# EAGLE design Arduino-Pro-Mini-v11 (EAGLE 5.11)
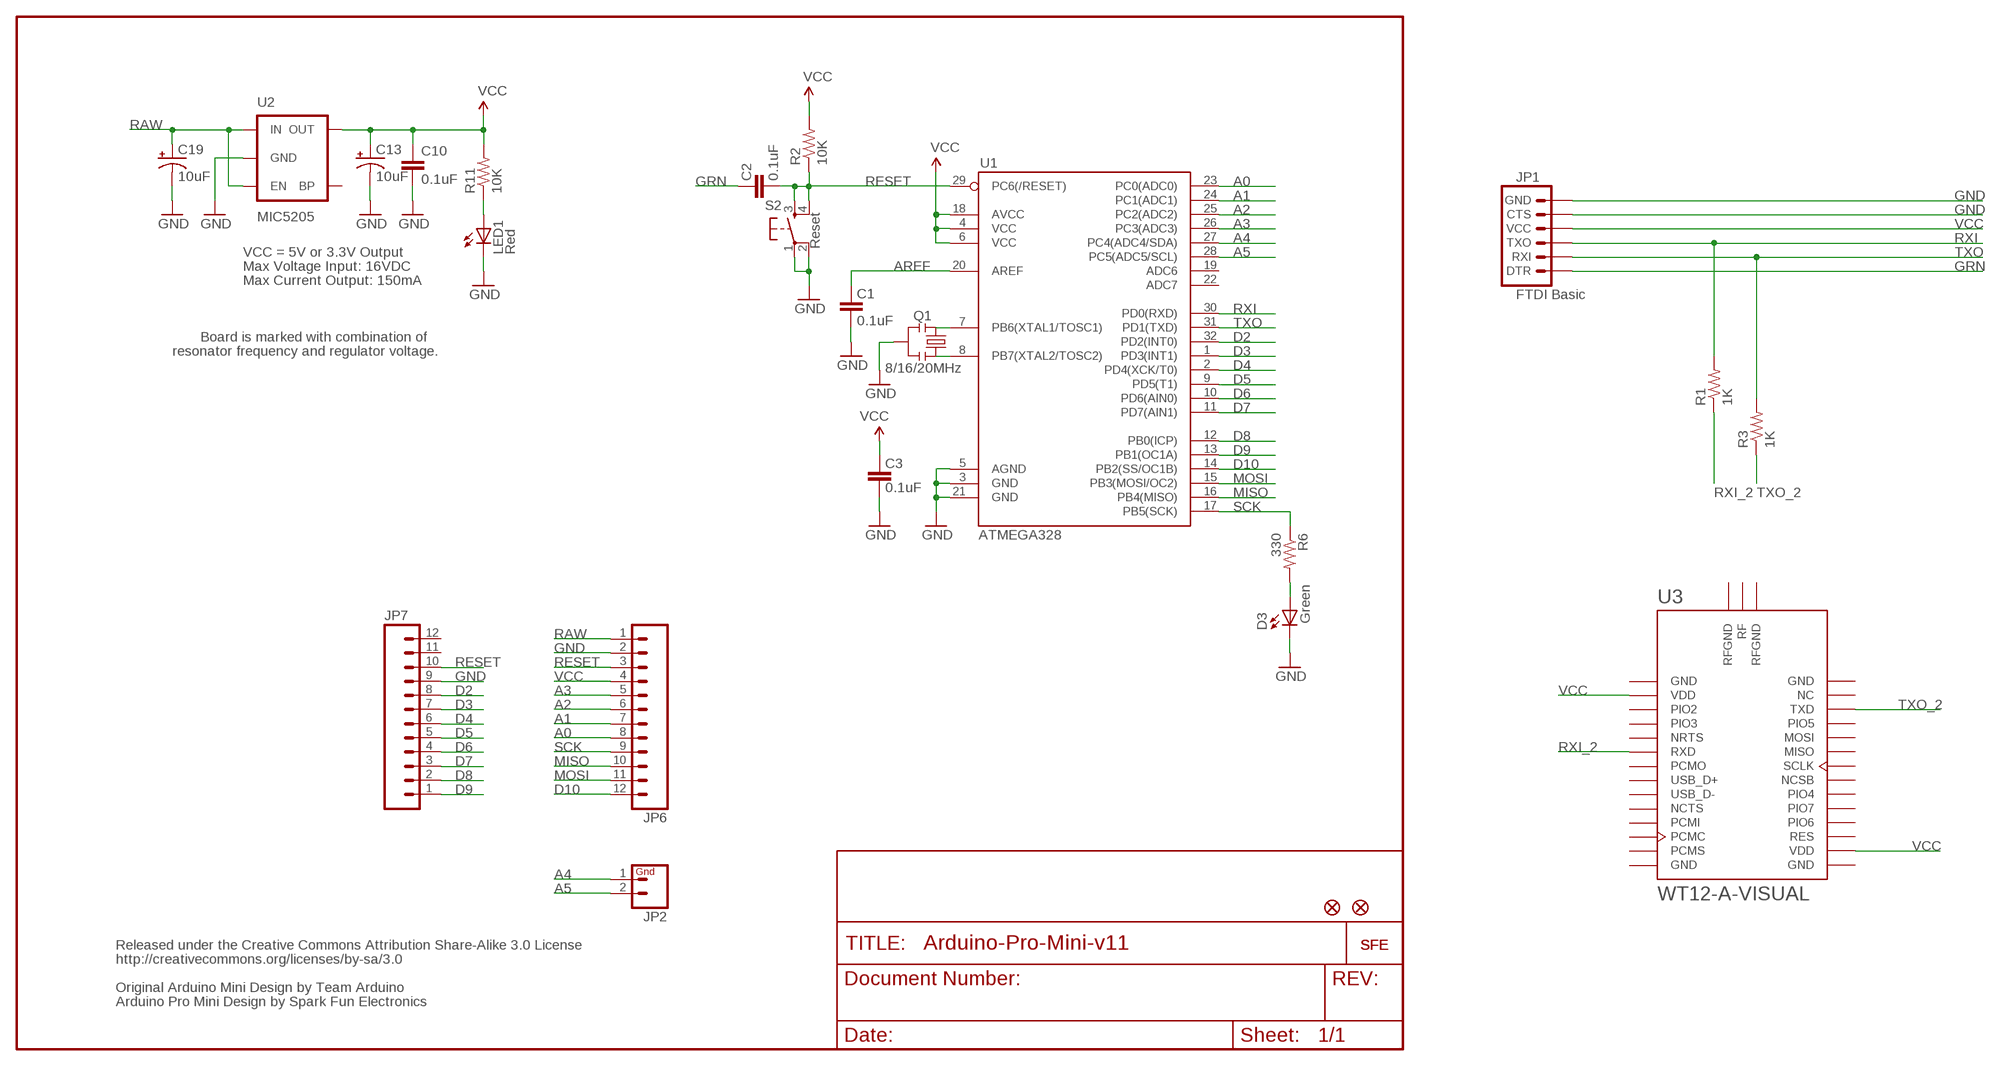
[diagram p0: schematic, sheet 1]

## Parts
C1  0.1uF  CAP0402  [C0402]
C2  0.1uF  CAP0402  [C0402]
C3  0.1uF  CAP0402  [C0402]
C10  0.1uF  CAP0402  [C0402]
C13  10uF  CAP_POL1206  [EIA3216]
C19  10uF  CAP_POL1206  [EIA3216]
D3  Green  LED0603  [LED-0603]
JP1  FTDI Basic  ARDUINO_SERIAL_PROGRAMPTH  [1X06]
JP2  M02PTH  [1X02]
JP6  M12PTH  [1X12]
JP7  M12PTH  [1X12]
LED1  Red  LED0603  [LED-0603]
Q1  8/16/20MHz  RESONATORSMD  [RESONATOR-SMD]
R1  1K  RESISTOR0402  [C0402]
R2  10K  RESISTOR0402  [C0402]
R3  1K  RESISTOR0402  [C0402]
R6  330  RESISTOR0402  [C0402]
R11  10K  RESISTOR0402  [C0402]
S2  Reset  TAC_SWITCHSND  [TACTILE_SWITCH_SMD]
U1  ATMEGA328  ATMEGA168  [TQFP32-08]
U2  MIC5205  V_REG_LDOSMD  [SOT23-5]
U3  WT12-A-VISUAL  [WT12-A]
U$1  LOGO-SFESK  [SFE-LOGO-FLAME]
U$2  FIDUCIAL1X2  [FIDUCIAL-1X2]
U$4  FIDUCIAL1X2  [FIDUCIAL-1X2]
U$11  LOGO-SFENEW  [SFE-NEW-WEBLOGO]

## Nets
A0: JP6.8 U1.23(PC0(ADC0))
A1: JP6.7 U1.24(PC1(ADC1))
A2: JP6.6 U1.25(PC2(ADC2))
A3: JP6.5 U1.26(PC3(ADC3))
A4: JP2.1 U1.27(PC4(ADC4/SDA))
A5: JP2.2 U1.28(PC5(ADC5/SCL))
AREF: C1.2 U1.20(AREF)
D2: JP7.8 U1.32(PD2(INT0))
D3: JP7.7 U1.1(PD3(INT1))
D4: JP7.6 U1.2(PD4(XCK/T0))
D5: JP7.5 U1.9(PD5(T1))
D6: JP7.4 U1.10(PD6(AIN0))
D7: JP7.3 U1.11(PD7(AIN1))
D8: JP7.2 U1.12(PB0(ICP))
D9: JP7.1 U1.13(PB1(OC1A))
D10: JP6.12 U1.14(PB2(SS/OC1B))
GND [vcc]: C1.1 C3.1 C10.2 C13.C(-) C19.C(-) D3.C JP1.5(CTS) JP1.6(GND) JP6.2 JP7.9 LED1.C Q1.2 S2.1 S2.2 U1.3(GND) U1.5(AGND) U1.21(GND) U2.2(GND)
GRN: C2.2 JP1.1(DTR)
MISO: JP6.10 U1.16(PB4(MISO))
MOSI: JP6.11 U1.15(PB3(MOSI/OC2))
N$1: Q1.1 U1.8(PB7(XTAL2/TOSC2))
N$2: Q1.3 U1.7(PB6(XTAL1/TOSC1))
N$7: D3.A R6.2
N$38: LED1.A R11.1
RAW [vcc]: C19.A(+) JP6.1 U2.1(IN) U2.3(EN)
RESET: C2.1 JP6.3 JP7.10 R2.1 S2.3 S2.4 U1.29(PC6(/RESET))
RXI: JP1.3(TXO) R1.2 U1.30(PD0(RXD))
RXI_2: R1.1 U3.RXD
SCK: JP6.9 R6.1 U1.17(PB5(SCK))
TXO: JP1.2(RXI) R3.2 U1.31(PD1(TXD))
TXO_2: R3.1 U3.TXD
VCC: C3.2 C10.1 C13.A(+) JP1.4(VCC) JP6.4 R2.2 R11.2 U1.4(VCC) U1.6(VCC) U1.18(AVCC) U2.5(OUT) U3.VDD1(VDD) U3.VDD2(VDD)
Unconnected: JP7.11 JP7.12 U1.19(ADC6) U1.22(ADC7) U2.4(BP) U3.MISO U3.MOSI U3.NC U3.NCSB U3.NCTS U3.NRTS U3.PCMC U3.PCMI U3.PCMO U3.PCMS U3.PIO2 U3.PIO3 U3.PIO4 U3.PIO5 U3.PIO6 U3.PIO7 U3.RES U3.RF U3.RFGND1(RFGND) U3.RFGND2(RFGND) U3.SCLK U3.USB_D+ U3.USB_D-

## Notes on the sheet
- VCC = 5V or 3.3V Output
- Max Voltage Input: 16VDC
- Max Current Output: 150mA
- Board is marked with combination of
- resonator frequency and regulator voltage.
- Released under the Creative Commons Attribution Share-Alike 3.0 License
- http://creativecommons.org/licenses/by-sa/3.0
- Original Arduino Mini Design by Team Arduino
- Arduino Pro Mini Design by Spark Fun Electronics

## Power pins joined to a net without a drawn wire
GND: U3.GND1(GND) U3.GND2(GND) U3.GND3(GND) U3.GND4(GND)

## Library data of the parts
C1-C3 C10 = SparkFun:CAP: Capacitor Standard 0603 ceramic capacitor, and 0.1" leaded capacitor.
C13 C19 = SparkFun:CAP_POL: Capacitor Polarized These are standard SMD and PTH capacitors. Normally 10uF, 47uF, and 100uF in electrolytic and tantalum varieties. Always verify the external diameter of the through hole cap, it varies with capacity, voltage, and manufacturer. The EIA devices should be standard.
D3 LED1 = SparkFun:LED: LEDs Standard schematic elements and footprints for 5mm, 3mm, 1206, and 0603 sized LEDs. 5mm - Spark Fun Electronics SKU : COM-00529 (and others)
JP1 = SparkFun:ARDUINO_SERIAL_PROGRAM
JP2 = SparkFun:M02: Header 2 Standard 2-pin 0.1" header. Use with straight break away headers (SKU : PRT-00116), right angle break away headers (PRT-00553), swiss pins (PRT-00743), machine pins (PRT-00117), and female headers (PRT-00115). Molex polarized connector foot print use with SKU : PRT-08233 with associated crimp pins and housings.
JP6 JP7 = SparkFun:M12: Header 12 Standard 12-pin 0.1" header. Use with straight break away headers (SKU : PRT-00116), right angle break away headers (PRT-00553), swiss pins (PRT-00743), machine pins (PRT-00117), and female headers (PRT-00115).
Q1 = SparkFun:RESONATOR: Resonator Small SMD resonator. This is the itty bitty 10/20MHz resonators with built in caps. CSTCE10M0G55 and CSTCE20M0V53. Footprint has been reviewed closely but hasn't been tested yet.
R1-R3 R6 R11 = SparkFun:RESISTOR: Resistor Basic schematic elements and footprints for 0603, 1206, and PTH 1/10th watt (small) resistors.
S2 = SparkFun:TAC_SWITCH: Momentary Switch Button commonly used for reset or general input. Spark Fun Electronics SKU : COM-00097
U1 = SparkFun:ATMEGA168
U2 = SparkFun:V_REG_LDO: Voltage Regulator LDO Standard 150mA LDO voltage regulator in SOT-23 layout. Micrel part MIC5205. BP (by-pass) pin is used to lower output noise with 470pF cap.
U3 = bluegiga:WT12-A-VISUAL: Class 2 Bluetooth 2.1 + EDR module, chip antenna and RF pins
U$1 U$11 = SparkFun:LOGO-SFE: Spark Fun Electronics PCB Logo This is the standard Spark Fun Electronics PCB logo.
U$2 U$4 = SparkFun:FIDUCIAL: Fiducial Alignment Points Various fiducial points for machine vision alignment.

## Net classes
0 default: width 0.203 mm
1 vcc: width 0.254 mm

## Board
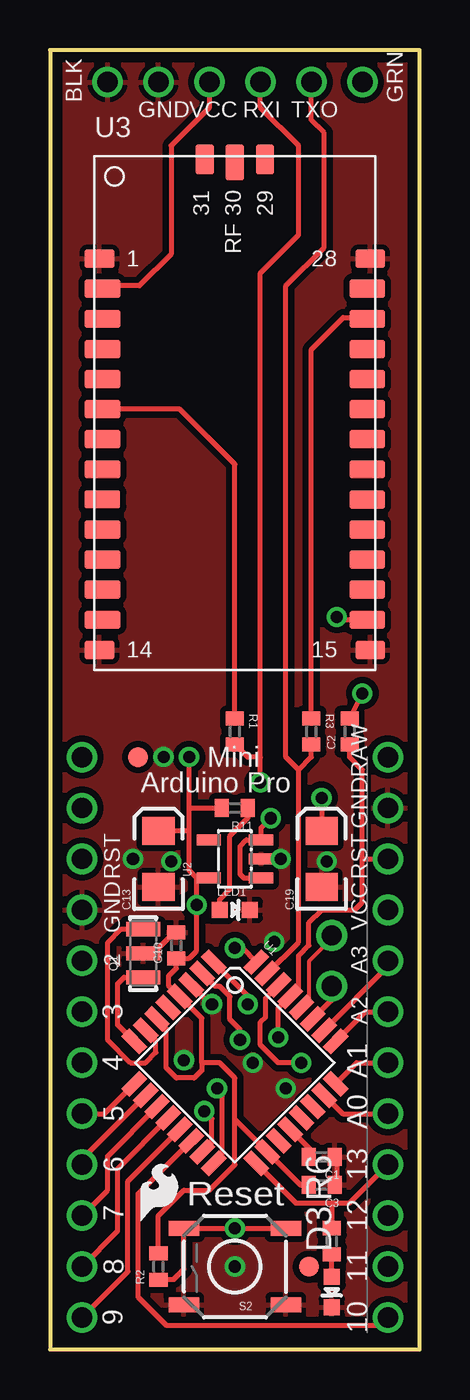
[diagram p1: board, top side]
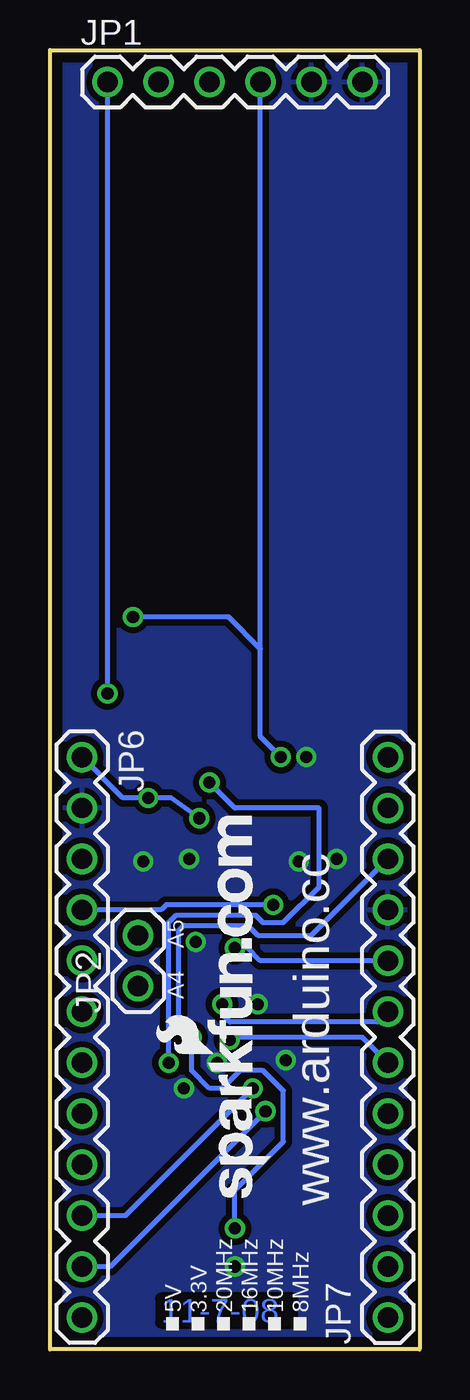
[diagram p2: board, bottom side, seen from below]

Size 18.41 x 64.77 mm. Coordinates in mm from the lower left corner, seen from the top.
Outline: 0,64.77 0,0 18.42,0 18.42,64.77 0,64.77
Copper layers (1*16): Top 0.035mm / dielectric 1.5mm / Bottom 0.035mm
Design rules "8mils": minimum track width 8mil, minimum drill 0.6mm, track to track 8mil, track to pad 8mil, pad to pad 8mil, via to via 8mil, smd to smd 0mil, copper to edge 20mil, drill to drill 10mil, minimum pad ring 8mil, minimum via ring 8mil, stop-mask expansion 0mil, vias tented up to drill 0mil, thermal gap 10mil

### Footprints (pad centres in the part's own frame; a part is rotated, then mirrored left to right if it is on the bottom)
C0402 = smd 0.7 x 0.9: 1 -0.65,0; 2 0.65,0
EIA3216 = smd 1.4 x 1.6: A 1.4,0; C -1.4,0
LED-0603 = smd 0.8 x 0.8: A 0,-0.75; C 0,0.75
1X06 = drill 1.016 round: 1 0,0; 2 2.54,0; 3 5.08,0; 4 7.62,0; 5 10.16,0; 6 12.7,0
1X02 = drill 1.016 round: 1 0,0; 2 2.54,0
1X12 = drill 1.016 round: 1 0,0; 2 2.54,0; 3 5.08,0; 4 7.62,0; 5 10.16,0; 6 12.7,0; 7 15.24,0; 8 17.78,0; 9 20.32,0; 10 22.86,0; 11 25.4,0; 12 27.94,0
RESONATOR-SMD = smd 0.7 x 1.7: 1 -1.2,0; 2 0,0; 3 1.2,0
TACTILE_SWITCH_SMD = smd 1.524 x 0.762: 1 -2.54,1.905; 2 2.54,1.905; 3 -2.54,-1.905; 4 2.54,-1.905
TQFP32-08 = smd 1.27 x 0.559: 1 -4.293,2.8; 2 -4.293,2; 3 -4.293,1.2; 4 -4.293,0.4; 5 -4.293,-0.4; 6 -4.293,-1.2; 7 -4.293,-2; 8 -4.293,-2.8; 17 4.293,-2.8; 18 4.293,-2; 19 4.293,-1.2; 20 4.293,-0.4; 21 4.293,0.4; 22 4.293,1.2; 23 4.293,2; 24 4.293,2.8 | smd 0.559 x 1.27: 9 -2.8,-4.293; 10 -2,-4.293; 11 -1.2,-4.293; 12 -0.4,-4.293; 13 0.4,-4.293; 14 1.2,-4.293; 15 2,-4.293; 16 2.8,-4.293; 25 2.8,4.293; 26 2,4.293; 27 1.2,4.293; 28 0.4,4.293; 29 -0.4,4.293; 30 -1.2,4.293; 31 -2,4.293; 32 -2.8,4.293
SOT23-5 = smd 0.55 x 1.2: 1 -0.95,-1.3; 2 0,-1.3; 3 0.95,-1.3; 4 0.95,1.3; 5 -0.95,1.3
WT12-A = smd 1.478 x 0.914: GND1 -6.75,7.7; GND2 -6.75,-11.8; GND3 6.75,-11.8; GND4 6.75,7.7 | smd 1.778 x 0.914: MISO 6.6,0.2; MOSI 6.6,1.7; NC 6.6,6.2; NCSB 6.6,-2.8; NCTS -6.6,-5.8; NRTS -6.6,1.7; PCMC -6.6,-8.8; PCMI -6.6,-7.3; PCMO -6.6,-1.3; PCMS -6.6,-10.3; PIO2 -6.6,4.7; PIO3 -6.6,3.2; PIO4 6.6,-4.3; PIO5 6.6,3.2; PIO6 6.6,-7.3; PIO7 6.6,-5.8; RES 6.6,-8.8; RXD -6.6,0.2; SCLK 6.6,-1.3; TXD 6.6,4.7; USB_D+ -6.6,-2.8; USB_D- -6.6,-4.3; VDD1 -6.6,6.2; VDD2 6.6,-10.3 | smd 0.914 x 1.778: RF 0,12.5 | smd 0.914 x 1.478: RFGND1 1.5,12.65; RFGND2 -1.5,12.65
FIDUCIAL-1X2 = smd 1 x 1: 1 0,0

### Placement (x,y rotation side)
C1  13.53,9.59 180 top
C2  14.92,30.8 90 top
C3  13.53,8.19 180 top
C10  6.29,20.13 90 top
C13  5.4,24.45 90 top
C19  13.53,24.45 90 top
D3  14.03,2.86 180 top
JP1  15.56,63.18 0 bottom
JP2  14.03,18.1 90 bottom
JP6  16.83,29.53 270 bottom
JP7  1.59,1.59 90 bottom
LED1  9.21,21.91 270 top
Q1  4.64,19.75 90 top
R1  9.21,30.8 270.1 top
R2  5.4,4.13 90 top
R3  13.02,30.8 270.1 top
R6  14.03,5.4 270 top
R11  9.21,26.99 180 top
S2  9.21,4.13 180 top
U1  9.21,14.29 315 top
U2  9.21,24.45 90 top
U3  9.21,46.67 0 top
U$1  4.51,6.41 0 top
U$2  12.89,4.13 0 top
U$4  4.38,29.53 0 top
U$11  7.43,7.56 90 bottom

### Tracks (layer width: path | path; a pad name or v marks a point on that pad's centre or on a via)
A0
  Top 0.254: U1.23 14.58,11.75 JP6.8
A1
  Top 0.254: U1.24 15.28,14.29 JP6.7
A2
  Top 0.254: U1.25 15.71,16.83 JP6.6
A3
  Top 0.254: U1.26 16.83,19.08 JP6.5
A4
  Top 0.254: U1.27 14.03,17.42 JP2.1
A5
  Top 0.203: U1.28 12.92,17.43 12.92,19.37 14.06,20.51 14.06,20.64 JP2.2
AREF
  Top 0.254: C1.2 13.02,9.59 13.02,9.91 U1.20
D2  (via drill 0.6)
  Top 0.254: U1.32 9.56,20 v9.21,20
  Bottom 0.254: JP7.8 7.94,19.37 8.57,20 v9.21,20
D3  (via drill 0.6)
  Top 0.254: U1.1 9.84,17.61 v9.84,17.21
  Bottom 0.254: v9.84,17.21 9.84,16.7 9.46,16.32 2.1,16.32 JP7.7
D4  (via drill 0.6)
  Top 0.254: v9.46,15.43 9.46,15.94 8.95,16.45 8.95,17.59 8.45,18.1 8.23,18.1 U1.2
  Bottom 0.254: JP7.6 2.86,15.56 9.21,15.56 v9.46,15.43
D5
  Top 0.254: U1.9 2.71,11.75 JP7.5
D6
  Top 0.254: U1.10 1.59,9.5 JP7.4
D7
  Top 0.254: U1.11 2.86,9.63 2.86,7.94 JP7.3
D8
  Top 0.254: U1.12 3.37,9.01 3.37,5.91 JP7.2
D9
  Top 0.254: U1.13 3.87,8.39 3.87,3.87 JP7.1
D10
  Top 0.254: JP6.12 16.45,1.21 5.78,1.21 4.38,2.6 4.38,7.76 U1.14
GND  (via drill 0.6)
  Top 0.254: C3.1 14.29,8.19 14.29,9.57 C1.1 14.29,9.59 14.29,9.77 | U1.3 7.94,17.25 v8.06,17.21 | C10.2 6.17,20.78 5.14,19.75 Q1.2 | U2.2 v11.49,24.45
  other vias: 11.75,13.02 10.1,14.29 9.21,4.13 5.65,29.53 11.16,20.31 6.67,14.41 13.78,24.32 4.13,24.45 6.03,24.32
  pour Top (isolate 0.305): 0,64.77 18.41,64.77 18.41,0 0,0
  pour Bottom (isolate 0.305): 0,64.77 18.41,64.77 18.41,0 0,0
GRN  (via drill 0.6)
  Top 0.254: C2.2 v15.56,32.7
  Bottom 0.254: v15.56,32.7 JP1.1
MISO  (via drill 0.6)
  Top 0.254: U1.16 8.57,9.69 8.57,12.76 v8.32,13.02
  Bottom 0.254: v8.32,13.02 14.67,6.67 JP6.10
MOSI  (via drill 0.6)
  Top 0.254: U1.15 8.06,10.32 8.06,11.49 v7.68,11.87
  Bottom 0.254: JP6.11 15.43,4.13 v7.68,11.87
N$1
  Top 0.254: U1.8 3.37,16.17 3.37,18.22 3.69,18.55 Q1.1
N$2
  Top 0.254: Q1.3 3.55,20.95 2.86,20.26 2.86,15.43 4,14.29 4.76,14.29 5.27,14.8 5.27,15.4 U1.7
N$7
  Top 0.254: D3.A R6.2
N$38
  Top 0.254: R11.1 9.86,26.49 8.95,25.59 8.95,22.92 8.45,22.42 8.45,21.91 LED1.A
RAW  (via drill 0.6)
  Top 0.254: v13.53,27.5 C19.A | U2.1 9.65,23.5 9.46,23.69 9.46,25.08 9.78,25.4 U2.3 10.51,26 v10.99,26.48
  Bottom 0.254: v10.99,26.48 12.38,27.5 v13.53,27.5 14.8,27.5 JP6.1
RESET  (via drill 0.6)
  Top 0.254: R2.1 5.41,3.49 6.16,3.49 6.67,4 S2.4 v9.21,6.03 S2.3 | v11.37,15.56 11.37,17.01 U1.29 12.38,18.03 12.38,19.62 12.89,20.13 12.89,21.27 13.53,21.91 15.18,21.91 15.56,22.29 15.56,24.45 | C2.1 14.92,29.53 15.56,28.89 15.56,24.45 | 15.56,24.45 JP6.3
  Bottom 0.254: v9.21,6.03 9.21,7.94 6.79,10.35 6.79,12.89 7.81,13.91 8.95,13.91 9.84,13.02 10.48,13.02 11.37,13.91 v11.37,15.56 12,16.19 12,20.89 11.75,21.15 8.57,21.15 8.06,20.64 5.4,20.64 JP7.10
RXI  (via drill 0.6)
  Top 0.254: U1.30 10.73,17.51 10.73,16.57 10.48,16.32 10.48,15.18 11.37,14.29 v12.51,14.29 | v10.48,28.26 10.48,29.53 | 9.22,30.15 9.84,29.53 10.48,29.53 | JP1.3 10.48,61.91 12.38,60.01 12.38,55.56 10.48,53.66 10.48,29.53
  Top 0.406: 9.22,30.15 R1.2
  Bottom 0.254: v12.51,14.29 12.51,21.27 12.13,21.65 8.19,21.65 7.81,21.27 6.79,21.27 5.02,23.05 5.02,26.99 9.21,26.99 v10.48,28.26
RXI_2
  Top 0.254: R1.1 9.21,44.13 6.47,46.87 U3.RXD
  Top 0.406: R1.1
SCK
  Top 0.254: 14.03,7.3 14.92,7.3 JP6.9 | 14.03,7.3 R6.1 | U1.17 12.23,7.3 14.03,7.3
TXO
  Top 0.254: U1.31 12.38,20.29 12.38,27.62 12.38,28.89 | 12.38,28.89 11.75,29.53 11.75,53.02 13.65,54.93 13.65,60.64 13.02,61.28 JP1.2 | 12.38,28.89 13.02,29.53 R3.2
  Top 0.406: R3.2
TXO_2
  Top 0.254: R3.1 13.02,49.85 14.6,51.43 15.75,51.43 U3.TXD
VCC  (via drill 0.6)
  Top 0.254: C13.A 6.92,25.84 | 9.25,11.41 U1.18 12.48,8.19 C3.2 13.02,8.19 | 9.25,11.41 9.21,11.46 | R2.2 5.4,6.67 6.67,7.94 7.94,7.94 9.21,9.21 9.21,11.37 | 9.21,11.37 9.25,11.41 | 9.21,11.37 9.21,13.53 8.45,14.29 7.56,14.29 | 6.43,17.61 6.41,17.59 | 6.43,17.61 U1.4 7.56,16.5 7.56,14.29 | 7.3,23.5 U2.5 | 6.43,17.61 5.91,18.13 5.91,18.61 6.29,18.99 C10.1 6.27,19.48 6.29,19.49 6.92,19.49 7.3,19.88 v7.3,22.16 7.3,23.5 | 7.3,23.5 6.92,23.88 6.92,25.84 | 6.92,26.99 v6.92,29.53 | 6.92,25.84 6.92,26.99 | 6.92,26.99 R11.2 | 7.56,14.29 7.56,13.91 7.18,13.53 6.29,13.53 5.78,14.03 5.78,16.02 U1.6 | JP1.4 7.94,61.91 6.03,60.01 6.03,54.61 4.45,53.02 2.76,53.02 | U3.VDD2 14.43,36.37 v14.29,36.51
  Top 0.305: C10.1 6.16,19.49
  Top 0.406: 2.76,53.02 U3.VDD1
  Bottom 0.254: 7.3,22.29 v7.3,22.16 12.64,22.16 12.89,21.91 JP6.4 | 7.94,34.93 7.94,30.54 v6.92,29.53 | 7.94,34.93 JP1.4 | v14.29,36.51 9.52,36.51 7.94,34.93

### Text on the board
Bottom: 11-7-08
tPlace: BLK | GRN | GND | VCC | RXI | TXO | Mini | RAW | Arduino Pro | GND | RST | RST | VCC | GND | 2 | A3 | 3 | A2 | 4 | A1 | 5 | A0 | 6 | 13 | Reset | 7 | 12 | 8 | 11 | 9 | 10 | http://creativecommons.org/licenses/by-sa/3.0
bPlace: A5 | A4 | www.arduino.cc | 8MHz | 10MHz | 16MHz | 20MHz | 3.3V | 5V
tValues: Valid combinations: | 168V / 3.3V Reg / 8MHz | 168 / 5V Reg / 16MHz | 168 / 5V Reg / 20MHz | Mark back accordingly | Arduino Pro Mini